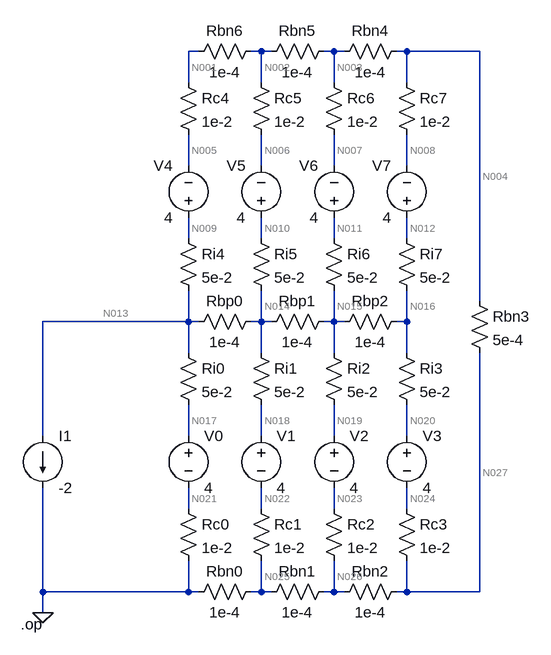
[diagram p0: schematic Wrapped.asc]
Wrapped.asc, the LTspice schematic file:
Version 4
SHEET 1 880 680
WIRE 80 -608 64 -608
WIRE 176 -608 160 -608
WIRE 192 -608 176 -608
WIRE 288 -608 272 -608
WIRE 304 -608 288 -608
WIRE 400 -608 384 -608
WIRE 512 -608 400 -608
WIRE 64 -560 64 -608
WIRE 176 -560 176 -608
WIRE 288 -560 288 -608
WIRE 400 -560 400 -608
WIRE 64 -432 64 -480
WIRE 176 -432 176 -480
WIRE 288 -432 288 -480
WIRE 400 -432 400 -480
WIRE 64 -320 64 -352
WIRE 176 -320 176 -352
WIRE 288 -320 288 -352
WIRE 400 -320 400 -352
WIRE 512 -224 512 -608
WIRE 64 -192 64 -240
WIRE 64 -192 -160 -192
WIRE 80 -192 64 -192
WIRE 176 -192 176 -240
WIRE 176 -192 160 -192
WIRE 192 -192 176 -192
WIRE 288 -192 288 -240
WIRE 288 -192 272 -192
WIRE 304 -192 288 -192
WIRE 400 -192 400 -240
WIRE 400 -192 384 -192
WIRE 64 -144 64 -192
WIRE 176 -144 176 -192
WIRE 288 -144 288 -192
WIRE 400 -144 400 -192
WIRE -160 -16 -160 -192
WIRE 64 -16 64 -64
WIRE 176 -16 176 -64
WIRE 288 -16 288 -64
WIRE 400 -16 400 -64
WIRE 64 96 64 64
WIRE 176 96 176 64
WIRE 288 96 288 64
WIRE 400 96 400 64
WIRE -160 224 -160 64
WIRE 64 224 64 176
WIRE 64 224 -160 224
WIRE 80 224 64 224
WIRE 176 224 176 176
WIRE 176 224 160 224
WIRE 192 224 176 224
WIRE 288 224 288 176
WIRE 288 224 272 224
WIRE 304 224 288 224
WIRE 400 224 400 176
WIRE 400 224 384 224
WIRE 512 224 512 -144
WIRE 512 224 400 224
WIRE -160 256 -160 224
FLAG -160 256 0
SYMBOL res 48 80 R0
SYMATTR InstName Rc0
SYMATTR Value 1e-2
SYMBOL voltage 176 -32 R0
WINDOW 123 0 0 Left 0
WINDOW 39 0 0 Left 0
SYMATTR InstName V1
SYMATTR Value 4
SYMBOL voltage 288 -32 R0
WINDOW 123 0 0 Left 0
WINDOW 39 0 0 Left 0
SYMATTR InstName V2
SYMATTR Value 4
SYMBOL voltage 400 -32 R0
WINDOW 123 0 0 Left 0
WINDOW 39 0 0 Left 0
SYMATTR InstName V3
SYMATTR Value 4
SYMBOL res 160 80 R0
SYMATTR InstName Rc1
SYMATTR Value 1e-2
SYMBOL res 272 80 R0
SYMATTR InstName Rc2
SYMATTR Value 1e-2
SYMBOL res 384 80 R0
SYMATTR InstName Rc3
SYMATTR Value 1e-2
SYMBOL res 48 -160 R0
SYMATTR InstName Ri0
SYMATTR Value 5e-2
SYMBOL res 160 -160 R0
SYMATTR InstName Ri1
SYMATTR Value 5e-2
SYMBOL res 272 -160 R0
SYMATTR InstName Ri2
SYMATTR Value 5e-2
SYMBOL res 384 -160 R0
SYMATTR InstName Ri3
SYMATTR Value 5e-2
SYMBOL res 176 -208 R90
WINDOW 0 0 56 VBottom 2
WINDOW 3 32 56 VTop 2
SYMATTR InstName Rbp0
SYMATTR Value 1e-4
SYMBOL res 288 -208 R90
WINDOW 0 0 56 VBottom 2
WINDOW 3 32 56 VTop 2
SYMATTR InstName Rbp1
SYMATTR Value 1e-4
SYMBOL res 400 -208 R90
WINDOW 0 0 56 VBottom 2
WINDOW 3 32 56 VTop 2
SYMATTR InstName Rbp2
SYMATTR Value 1e-4
SYMBOL res 176 208 R90
WINDOW 0 0 56 VBottom 2
WINDOW 3 32 56 VTop 2
SYMATTR InstName Rbn0
SYMATTR Value 1e-4
SYMBOL res 288 208 R90
WINDOW 0 0 56 VBottom 2
WINDOW 3 32 56 VTop 2
SYMATTR InstName Rbn1
SYMATTR Value 1e-4
SYMBOL res 400 208 R90
WINDOW 0 0 56 VBottom 2
WINDOW 3 32 56 VTop 2
SYMATTR InstName Rbn2
SYMATTR Value 1e-4
SYMBOL res 48 -336 R0
SYMATTR InstName Ri4
SYMATTR Value 5e-2
SYMBOL voltage 64 -336 R180
WINDOW 0 24 96 Left 2
WINDOW 3 24 16 Left 2
WINDOW 123 0 0 Left 0
WINDOW 39 0 0 Left 0
SYMATTR InstName V4
SYMATTR Value 4
SYMBOL voltage 176 -336 R180
WINDOW 0 24 96 Left 2
WINDOW 3 24 16 Left 2
WINDOW 123 0 0 Left 0
WINDOW 39 0 0 Left 0
SYMATTR InstName V5
SYMATTR Value 4
SYMBOL voltage 288 -336 R180
WINDOW 0 24 96 Left 2
WINDOW 3 24 16 Left 2
WINDOW 123 0 0 Left 0
WINDOW 39 0 0 Left 0
SYMATTR InstName V6
SYMATTR Value 4
SYMBOL voltage 400 -336 R180
WINDOW 0 24 96 Left 2
WINDOW 3 24 16 Left 2
WINDOW 123 0 0 Left 0
WINDOW 39 0 0 Left 0
SYMATTR InstName V7
SYMATTR Value 4
SYMBOL res 160 -336 R0
SYMATTR InstName Ri5
SYMATTR Value 5e-2
SYMBOL res 272 -336 R0
SYMATTR InstName Ri6
SYMATTR Value 5e-2
SYMBOL res 384 -336 R0
SYMATTR InstName Ri7
SYMATTR Value 5e-2
SYMBOL res 48 -576 R0
SYMATTR InstName Rc4
SYMATTR Value 1e-2
SYMBOL res 160 -576 R0
SYMATTR InstName Rc5
SYMATTR Value 1e-2
SYMBOL res 272 -576 R0
SYMATTR InstName Rc6
SYMATTR Value 1e-2
SYMBOL res 384 -576 R0
SYMATTR InstName Rc7
SYMATTR Value 1e-2
SYMBOL current -160 -16 R0
WINDOW 123 0 0 Left 0
WINDOW 39 0 0 Left 0
SYMATTR InstName I1
SYMATTR Value -2
SYMBOL res 496 -240 R0
SYMATTR InstName Rbn3
SYMATTR Value 5e-4
SYMBOL res 176 -624 R90
WINDOW 0 0 56 VBottom 2
WINDOW 3 32 56 VTop 2
SYMATTR InstName Rbn6
SYMATTR Value 1e-4
SYMBOL res 288 -624 R90
WINDOW 0 0 56 VBottom 2
WINDOW 3 32 56 VTop 2
SYMATTR InstName Rbn5
SYMATTR Value 1e-4
SYMBOL res 400 -624 R90
WINDOW 0 0 56 VBottom 2
WINDOW 3 32 56 VTop 2
SYMATTR InstName Rbn4
SYMATTR Value 1e-4
SYMBOL voltage 64 -32 R0
WINDOW 123 0 0 Left 0
WINDOW 39 0 0 Left 0
SYMATTR InstName V0
SYMATTR Value 4
TEXT -194 274 Left 2 !.op

The netlist it stands for:
* Wrapped.asc
Rc0 N021 0 1e-2
V1 N018 N022 4
V2 N019 N023 4
V3 N020 N024 4
Rc1 N022 N025 1e-2
Rc2 N023 N026 1e-2
Rc3 N024 N027 1e-2
Ri0 N013 N017 5e-2
Ri1 N014 N018 5e-2
Ri2 N015 N019 5e-2
Ri3 N016 N020 5e-2
Rbp0 N014 N013 1e-4
Rbp1 N015 N014 1e-4
Rbp2 N016 N015 1e-4
Rbn0 N025 0 1e-4
Rbn1 N026 N025 1e-4
Rbn2 N027 N026 1e-4
Ri4 N009 N013 5e-2
V4 N009 N005 4
V5 N010 N006 4
V6 N011 N007 4
V7 N012 N008 4
Ri5 N010 N014 5e-2
Ri6 N011 N015 5e-2
Ri7 N012 N016 5e-2
Rc4 N001 N005 1e-2
Rc5 N002 N006 1e-2
Rc6 N003 N007 1e-2
Rc7 N004 N008 1e-2
I1 N013 0 -2
Rbn3 N004 N027 5e-4
Rbn6 N002 N001 1e-4
Rbn5 N003 N002 1e-4
Rbn4 N004 N003 1e-4
V0 N017 N021 4
.op
.backanno
.end

* Results of the author's LTspice run, read from the files saved beside the schematic
* Operating Point:
*   V(n021) = 2.633 mV
*   V(n018) = 4.003 V
*   V(n022) = 2.753 mV
*   V(n019) = 4.003 V
*   V(n023) = 2.86 mV
*   V(n020) = 4.003 V
*   V(n024) = 2.954 mV
*   V(n025) = 173.7 µV
*   V(n026) = 321.5 µV
*   V(n027) = 444 µV
*   V(n013) = 4.016 V
*   V(n017) = 4.003 V
*   V(n014) = 4.016 V
*   V(n015) = 4.016 V
*   V(n016) = 4.016 V
*   V(n009) = 4.004 V
*   V(n005) = 3.531 mV
*   V(n010) = 4.003 V
*   V(n006) = 3.486 mV
*   V(n011) = 4.003 V
*   V(n007) = 3.429 mV
*   V(n012) = 4.003 V
*   V(n008) = 3.359 mV
*   V(n001) = 1.078 mV
*   V(n002) = 1.053 mV
*   V(n003) = 1.004 mV
*   V(n004) = 931 µV
*   I(I1) = -2 A
*   I(Rbn4) = -731.1 mA
*   I(Rbn5) = -488.6 mA
*   I(Rbn6) = -245.4 mA
*   I(Rbn3) = 973.9 mA
*   I(Rc7) = -242.8 mA
*   I(Rc6) = -242.5 mA
*   I(Rc5) = -243.3 mA
*   I(Rc4) = -245.4 mA
*   I(Ri7) = -242.8 mA
*   I(Ri6) = -242.5 mA
*   I(Ri5) = -243.3 mA
*   I(Ri4) = -245.4 mA
*   I(Rbn2) = 1.225 A
*   I(Rbn1) = 1.479 A
*   I(Rbn0) = 1.737 A
*   I(Rbp2) = -493.8 mA
*   I(Rbp1) = -990.1 mA
*   I(Rbp0) = -1.491 A
*   I(Ri3) = 251 mA
*   I(Ri2) = 253.8 mA
*   I(Ri1) = 257.9 mA
*   I(Ri0) = 263.3 mA
*   I(Rc3) = 251 mA
*   I(Rc2) = 253.8 mA
*   I(Rc1) = 257.9 mA
*   I(Rc0) = 263.3 mA
*   I(V0) = 263.3 mA
*   I(V7) = 242.8 mA
*   I(V6) = 242.5 mA
*   I(V5) = 243.3 mA
*   I(V4) = 245.4 mA
*   I(V3) = 251 mA
*   I(V2) = 253.8 mA
*   I(V1) = 257.9 mA